# Altium schematic sheet Main.SchDoc
size 381 x 241 mm; SheetNumber: 1; SheetTotal: 1
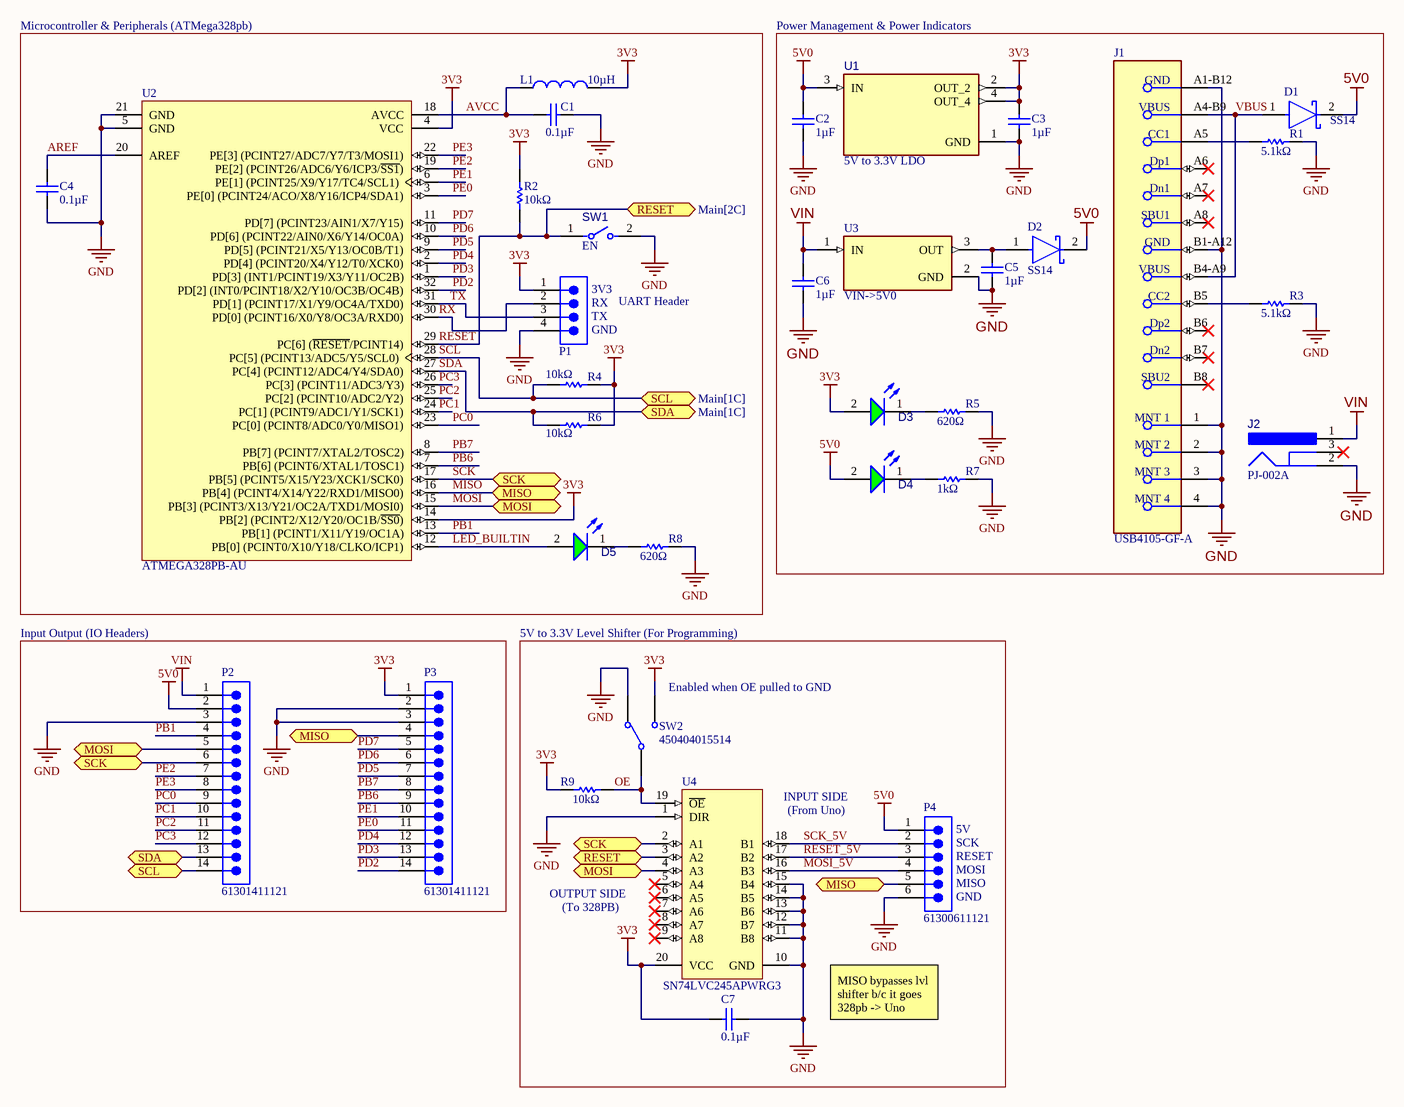
[diagram p0: Main.SchDoc]

## Parts
C1  0.1µF  [CAPC3216X100X50LL20T25]
C2  1µF  [CAPC3216X110X50LL20T25]
C3  1µF  [CAPC3216X110X50LL20T25]
C4  0.1µF  [CAPC3216X100X50LL20T25]
C5  1µF  [CAPC3216X110X50LL20T25]
C6  1µF  [CAPC3216X110X50LL20T25]
C7  0.1µF  [CAPC3216X100X50LL20T25]
D1  SS14  [FP-403AE-MFG]
D2  SS14  [FP-403AE-MFG]
D3  150120GS75000  [WL-SMCW_1206_150120xx75000]  (value not drawn)
D4  150120GS75000  [WL-SMCW_1206_150120xx75000]  (value not drawn)
D5  150120GS75000  [WL-SMCW_1206_150120xx75000]  (value not drawn)
J1  USB4105-GF-A  [FP-USB4105-GF-A-MFG]
J2  PJ-002A  [CUI-PJ-002A_V]
L1  10µH  [WE-MI_1206_L3.2W1.6H1.1]
P1  61300411121  [61300411121]  (value not drawn)
P2  61301411121  [61301411121]
P3  61301411121  [61301411121]
P4  61300611121  [61300611121]
R1  5.1kΩ  [RESC3116X65X40LL10T20]
R2  10kΩ  [RESC3116X65X40LL10T20]
R3  5.1kΩ  [RESC3116X65X40LL10T20]
R4  10kΩ  [RESC3116X65X40LL10T20]
R5  620Ω  [RESC3116X65X40LL10T20]
R6  10kΩ  [RESC3116X65X40LL10T20]
R7  1kΩ  [RESC3116X65X40LL10T20]
R8  620Ω  [RESC3116X65X40LL10T20]
R9  10kΩ  [RESC3116X65X40LL10T20]
SW1  EN  [FP-B3U-1000P-B-MFG]
SW2  450404015514  [450404015514]
U1  TLV1117LV33DCYR  [VREG_TLV1117LV33DCYR]  (value not drawn)
U2  ATMEGA328PB-AU  [ATML-32A_L]
U3  VIN->5V0  [DPAK229P990X238-4N]
U4  SN74LVC245APWRG3  [PW0020A_N]

## Blocks framed on the sheet
Input Output (IO Headers): P2 P3

## Ports
MISO (bidir, see Main[1C], Main[2B]), MISO (bidir, see Main[1C], Main[3C]), MISO (bidir, see Main[2B], Main[3C]), MOSI (bidir, see Main[1C], Main[2B]), MOSI (bidir, see Main[1C], Main[2C]), MOSI (bidir, see Main[2B], Main[2C]), RESET (bidir, see Main[2A]), RESET (bidir, see Main[2C]), SCK (bidir, see Main[1C], Main[2B]), SCK (bidir, see Main[1C], Main[2C]), SCK (bidir, see Main[2B], Main[2C]), SCL (bidir, see Main[1C]), SCL (bidir, see Main[2B]), SDA (bidir, see Main[1C]), SDA (bidir, see Main[2B])

## Nets
3V3: C3.2 C7.1 D3.2(A) L1.2 P1.1 P3.1 R2.2 R4.2 R6.2 R9.2 SW2.L2 U1.2(OUT_2) U1.4(OUT_4) U2.4(VCC) U2.14(PB[2]_(PCINT2/X12/Y20/OC1B/~{SS0})) U4.20(VCC)
5V0: C2.2 D1.2(C) D2.2(C) D4.2(A) P2.2 P4.1 U1.3(IN)
GND: C1.1 C2.1 C3.1 C4.2 C5.1 C6.1 C7.2 J1.1(MNT_1) J1.2(MNT_2) J1.3(MNT_3) J1.4(MNT_4) J1.A1-B12(GND) J1.B1-A12(GND) J2.2 P1.4 P2.3 P3.2 P3.3 P4.6 R1.1 R3.2 R5.2 R7.2 R8.2 SW1.2 SW2.L1 U1.1(GND) U2.5(GND) U2.21(GND) U3.2(GND) U4.1(DIR) U4.10(GND) U4.11(B8) U4.12(B7) U4.13(B6) U4.14(B5) U4.15(B4)
VIN: C6.2 J2.1 P2.1 U3.1(IN)
AREF: C4.1 U2.20(AREF)
AVCC: C1.2 L1.1 U2.18(AVCC)
LED_BUILTIN: D5.2(A) U2.12(PB[0]_(PCINT0/X10/Y18/CLKO/ICP1))
MISO: P3.4 P4.5 U2.16(PB[4]_(PCINT4/X14/Y22/RXD1/MISO0)) ; port MISO
MOSI: P2.5 U2.15(PB[3]_(PCINT3/X13/Y21/OC2A/TXD1/MOSI0)) U4.4(A3) ; port MOSI
MOSI_5V: P4.4 U4.16(B3)
OE: R9.1 SW2.COM U4.19(~{OE})
PB1: P2.4 U2.13(PB[1]_(PCINT1/X11/Y19/OC1A))
PB6: P3.9 U2.7(PB[6]_(PCINT6/XTAL1/TOSC1))
PB7: P3.8 U2.8(PB[7]_(PCINT7/XTAL2/TOSC2))
PC0: P2.9 U2.23(PC[0]_(PCINT8/ADC0/Y0/MISO1))
PC1: P2.10 U2.24(PC[1]_(PCINT9/ADC1/Y1/SCK1))
PC2: P2.11 U2.25(PC[2]_(PCINT10/ADC2/Y2))
PC3: P2.12 U2.26(PC[3]_(PCINT11/ADC3/Y3))
PD2: P3.14 U2.32(PD[2]_(INT0/PCINT18/X2/Y10/OC3B/OC4B))
PD3: P3.13 U2.1(PD[3]_(INT1/PCINT19/X3/Y11/OC2B))
PD4: P3.12 U2.2(PD[4]_(PCINT20/X4/Y12/T0/XCK0))
PD5: P3.7 U2.9(PD[5]_(PCINT21/X5/Y13/OC0B/T1))
PD6: P3.6 U2.10(PD[6]_(PCINT22/AIN0/X6/Y14/OC0A))
PD7: P3.5 U2.11(PD[7]_(PCINT23/AIN1/X7/Y15))
PE0: P3.11 U2.3(PE[0]_(PCINT24/ACO/X8/Y16/ICP4/SDA1))
PE1: P3.10 U2.6(PE[1]_(PCINT25/X9/Y17/TC4/SCL1))
PE2: P2.7 U2.19(PE[2]_(PCINT26/ADC6/Y6/ICP3/~{SS1}))
PE3: P2.8 U2.22(PE[3]_(PCINT27/ADC7/Y7/T3/MOSI1))
RESET: R2.1 SW1.1 U2.29(PC[6]_(~{RESET}/PCINT14)) U4.3(A2) ; port RESET
RESET_5V: P4.3 U4.17(B2)
RX: P1.2 U2.30(PD[0]_(PCINT16/X0/Y8/OC3A/RXD0))
SCK: P2.6 U2.17(PB[5]_(PCINT5/X15/Y23/XCK1/SCK0)) U4.2(A1) ; port SCK
SCK_5V: P4.2 U4.18(B1)
SCL: P2.14 R4.1 U2.28(PC[5]_(PCINT13/ADC5/Y5/SCL0)) ; port SCL
SDA: P2.13 R6.1 U2.27(PC[4]_(PCINT12/ADC4/Y4/SDA0)) ; port SDA
TX: P1.3 U2.31(PD[1]_(PCINT17/X1/Y9/OC4A/TXD0))
VBUS: D1.1(A) J1.A4-B9(VBUS) J1.B4-A9(VBUS)
NetC5_2: C5.2 D2.1(A) U3.3(OUT)
NetD3_1: D3.1(K) R5.1
NetD4_1: D4.1(K) R7.1
NetD5_1: D5.1(K) R8.1
NetJ1_A5: J1.A5(CC1) R1.2
NetJ1_B5: J1.B5(CC2) R3.1

Not connected (* = marked no-connect by the designer): J1 A6(Dp1)* A7(Dn1)* A8(SBU1)* B6(Dp2)* B7(Dn2)* B8(SBU2)*; J2 3*; U4 5(A4)* 6(A5)* 7(A6)* 8(A7)* 9(A8)*

## Notes on the sheet
- Microcontroller & Peripherals (ATMega328pb)
- Power Management & Power Indicators
- (near U1) 5V to 3.3V LDO
- 3V3
- (near P1) TX
- (near P1) RX
- GND
- UART Header
- 5V to 3.3V Level Shifter (For Programming)
- (near SW2) Enabled when OE pulled to GND
- (near U4) INPUT SIDE
- (near U4) (From Uno)
- (near P4) 5V
- (near P4) MISO
- (near P4) MOSI
- (near P4) SCK
- (near P4) RESET
- OUTPUT SIDE
- (To 328PB)
- (near P4) GND
- MISO bypasses lvl shifter b/c it goes 328pb -> Uno

## Library data of the parts
C1 C4 C7 = CMP-1664-00001-4: Chip Capacitor, 100 nF, +/- 10%, 25 V, -55 to 125 degC, 1206 (3216 Metric), RoHS, Tape and Reel; Manufacturer: Kemet; Voltage Rating: 25 V; ComponentLink1URL: http://www.kemet.com/; Max Operating Temperature: 125 degC; PackageReference: 1206; ComponentLink2URL: http://www.kemet.com/docfinder?Partnumber=C1206F104K3RACTU; ComponentLink1Description: Manufacturer URL; ComponentLink2Description: Datasheet; Length: 3.2 mm; Packaging: Tape and Reel; Height: 0.78 mm; Mounting Technology: Surface Mount; REACH SVHC: No SVHC; PackageDescription: 2-Pin Surface Mount Device, Body 3.2 x 1.6 mm; Min Operating Temperature: -55 degC; RoHSCompliant: true; DatasheetVersion: 02/2016; Package Quantity: 4000
C2 C3 C5 C6 = CMP-2000-06011-1: Chip Capacitor, 1 uF, +/- 10%, 50 V, -55 to 125 degC, 1206 (3216 Metric), RoHS, Tape and Reel; Manufacturer: Kemet; Case Height: 1mm; Dielectric: X7R; Voltage Rating: 50V; Capacitance: 1uF; Temperature Coefficient / Code: +/-15%; Case Length: 3.2mm; Case Width: 1.6mm; Type: SMDMLCCX7R6.3-250VDCCommericalGrade; Class: Class1; Capacitance - nF: 1000nF; Datasheet URL: http://www.kemet.com/docfinder?Partnumber=C1206C105K5RACTU; Product Category: MultilayerCeramicCapacitorsMLCC-SMD/SMT; Termination Style: SMD/SMT; Dimensions: 1.6mmWx3.2mmLx1mmH; Voltage Rating DC: 50V; Datasheet Version: 02/2016; Packaging: Reel; Brand: Kemet; RoHS: Details; Minimum Operating Temperature: -55C; Operating Temperature Range: -55Cto+125C; Package Reference: 1206; Manufacturer URL: http://www.kemet.com/; Product: GeneralTypeMLCCs; Tolerance: 10%; Package Description: 2-Pin Surface Mount Device, Body 3.2 x 1.6 mm; Mounting Technology: SurfaceMount; Case Code - mm: 3216; Maximum Operating Temperature: +125C; Series: C1206C; Factory Pack Quantity: 2500; Package / Case: 1206(3216metric); Case Code - in: 1206
D1 D2 = CMP-2000-04943-2: DIODE SCHOTTKY 40V 1A SMA; Manufacturer: ON Semiconductor; Peak Reverse Current: 0.2mA; Max Junction Temp: +125°C; Standoff Height: 0.05mm; Max Surge Forward Current: 40A; Mouser Description: Schottky Diodes & Rectifiers SMA 40V 1.0A; RoHS: TRUE; Lead Free: Yes; Manufacturer Part Number: SS14; Device Class L3: Schottky Diodes; Category: Diode; Automotive: No; Digikey Description: DIODE SCHOTTKY 40V 1A SMA; ComponentLink2Description: Datasheet; Device Class L2: Diodes; Height: 2.5mm; Temperature Range High: +125°C; ComponentLink2URL: https://www.onsemi.com/pub/Collateral/SS19-D.PDF; Device Class L1: Discrete Semiconductors; Package: 403AE; Octopart: https://octopart.com/ss14-on+semiconductor-29205033; Max Repetitive Reverse Voltage: 40V; Temperature Range Low: -65°C; Forward Current: 1A; Temperature: -65°C to +125°C
D3-D5 = CMP-1426-00014-4: WL-SMCW SMT Mono-Color Chip LED Waterclear; Dominant Wavelength: 525nm; Reverse Voltage: 5V; Max Junction Temperature (Tj): 95°C; Lens Style: Clear, Rectangular; Forward Voltage: 3.2V; Power Dissipation: 105mW; Peak Wavelength: 515nm; Test Current: 20mA; Color: Green; Forward Current: 100mA; Luminous Intensity: 450mcd; Viewing Angle: 140°; Case Code (Imperial): 1206; REACH SVHC: Unknown; Packaging: Tape and Reel; Max Operating Temperature: 85°C; Case/Package: 1206; Height: 680µm; Length: 3.2mm; Mount: Surface Mount; Min Operating Temperature: -40°C; Width: 1.6mm; Case Code (Metric): 3216; Max Reverse Voltage (DC): 5V; RoHS: Compliant; Wavelength: 525nm
J1 = CMP-245163-000001-1: CONN RCPT USB2.0 TYPEC 5A; Manufacturer: GCT; Voltage Rating: 20V; Is Female: yes; Current Rating: 5/6.25/1.25/0.25A; Number Of Contacts: 16; Conn Orientation: Right Angle; Device Class L1: Connectors; Category: Conn; Lead Free: Yes; RoHS: TRUE; Temperature Range High: +85°C; Digikey Description: CONN RCPT USB2.0 TYPEC 5A; Device Class L3: unset; ComponentLink2Description: Datasheet; Manufacturer Part Number: USB4105-GF-A; Package: 0; Usb Standard: USB 2.0; Device Class L2: USB Connectors; Automotive: No; Temperature Range Low: -40°C; Height: 3.46mm; Temperature: -40°C to +85°C; Contact Material: Gold,Nickel; ComponentLink2URL: https://gct.co/files/drawings/usb4105.pdf; Octopart: https://octopart.com/usb4105-gf-a-gct-106627878
J2 = CMP-2000-06895-2: Through Hole Right Angle DC Power Jack, 2.5 A, 2 mm Center Pin, 3 Position, -25 to 85 degC, RoHS, Bulk; Manufacturer: CUIInc.; Brand: CUI; Inside Contact Diameter: 2mm; Voltage Rating: 24V; Outside Contact Diameter: 6.5mm; Current Rating: 2.5A; Insulation Resistance: 50MOhms; Contact Gender: Male; Connector Type: DCPowerJack; Datasheet Version: Rev. 1.03, 04/2016; Housing Material: PolybutyleneTerephthalate(PBT); Operating Temperature Range: -25Cto+85C; Termination Style: ThroughHole; Product Category: DCPowerConnectors; Mounting Technology: ThroughHole; Mounting Style: ThroughHole; Factory Pack Quantity: 500; Contact Plating: Nickel; Package Reference: PJ-002A; Mounting Angle: Right; Package Description: 3-Pin Through Hole Device, Body 14.4 x 9 mm, Height 11 mm; Flammability Rating: UL94V-0; Manufacturer URL: http://www.cui.com/; Product: Jacks; Contact Material: Copper; Datasheet URL: http://www.cui.com/product/resource/pj-002a.pdf; RoHS: True
L1 = CMP-0221-00030-2: NexarPartId: 23259292; Max DC Current: 25mA; Inductance Tolerance: 10%; Core Material: Ferrite; Shielding: Unshielded; DC Resistance (DCR): 500mΩ; Self Resonant Frequency: 26MHz; Ambient Temperature Range Low: -55°C; RoHS: Compliant; Inductance: 10µH; Tolerance: 10%; Length: 3.2mm; Width: 1.6mm; Case/Package: SMD/SMT; Min Operating Temperature: -55°C; Ambient Temperature Range High: 85°C; Depth: 1.6mm; Current Rating: 25mA; Max Operating Temperature: 125°C; Height: 1.1mm
P1 = 61300411121: WR-PHD Pin Header, THT, Vertical, pitch 2.54mm, 1 Row, 4P; Manufacturer: Wurth Elektronik; Contact Resistance: 20mOhm; Rated Current: 3A; Working Voltage: 250V; Withstanding Voltage: 500V; Manufacturer Part Number: 61300411121; Category: Board-to-Board Connectors; Match Code: WR-PHD; ComponentLink1Description: Website Link; ComponentLink1URL: https://www.we-online.com/redexpert/article/61300411121?ad; ComponentLink2Description: Datasheet Link; ComponentLink2URL: https://www.we-online.com/redexpert/spec/61300411121?ad; Mount: Through Hole; Operating Temperature Max: 105°C; Operating Temperature Min: -40°C; Packaging: Bag; Gender: Pin Header; Number of Pins: 4; Number of Rows: 1; Orientation: Vertical; Pitch: 2.54mm
P2 P3 = CMP-1502-01091-3: NexarPartId: 32855543; Pitch: 2.54mm; Operating Supply Voltage: 250V; Contact Resistance: 20mΩ; Gender: Male; Connector Type: Male Pin; Number of Positions: 14; Current Rating: 3A; Height: 8.89mm; Packaging: Bulk; Min Operating Temperature: -40°C; Lead Free: Lead Free; Number of Rows: 1; Max Operating Temperature: 105°C; Orientation: Vertical; Color: Black; Mount: Through Hole; Lead Pitch: 2.54mm; Termination: Solder; Contact Material: Copper; REACH SVHC: Unknown; Voltage Rating: 250V; Number of Contacts: 14; RoHS: Compliant; Contact Mating Length: 5.9944mm; Number of Pins: 14; Contact Plating: Gold
P4 = CMP-1502-01070-3: NexarPartId: 20084590; Current Rating: 3A; Pitch: 2.54mm; Gender: Male; Operating Supply Voltage: 250V; Connector Type: Male Pin; Number of Positions: 6; Contact Resistance: 20mΩ; Packaging: Bulk; Number of Pins: 6; Number of Rows: 1; Contact Plating: Gold; Lead Free: Lead Free; RoHS: Compliant; Contact Mating Length: 5.9944mm; Voltage Rating: 250V; REACH SVHC: Unknown; Contact Gender: Male; Housing Material: PBT; Min Operating Temperature: -40°C; Lead Pitch: 2.54mm; Mount: Through Hole; Number of Contacts: 6; Max Operating Temperature: 105°C; Contact Material: Copper; Orientation: Vertical; Termination: Through Hole; Color: Black; Height: 8.89mm
R1 R3 = CMP-2003-03990-1: Manufacturer: Yageo; Part Number: RC1206JR-075K1L
R2 R4 R6 R9 = CMP-1014-00623-2: Chip Resistor, 10 KOhm, +/- 1%, 0.25 W, -55 to 155 degC, 1206 (3216 Metric), RoHS, Tape and Reel; Manufacturer: Yageo; Voltage Rating: 200V; Resistance: 10KOhm; Temperature Coefficient: 100ppm/degreesC; Power Rating: 250mW; Packaging: TapeandReel; Termination: SMD/SMT; REACH SVHC: Unknown; Tolerance: 1%; Height: 0.55mm; Composition: ThickFilm; Max Operating Temperature: 155degC; Datasheet Version: Rev. 5, 10/2016; Lead Free: LeadFree; Case Code (Metric): 3216; Depth: 1.6mm; Package Quantity: 5000; RoHSCompliant: true; Military Standard: Not; Case/Package: 1206; Case Code (Imperial): 1206; Min Operating Temperature: -55degC; Datasheet URL: http://www.yageo.com/NewPortal/yageodocoutput?fileName=/pdf/R-Chip/PYu-RC_Group_51_RoHS_L_5.pdf; Length: 3.1mm; Manufacturer URL: http://www.yageo.com/; Package Reference: 1206.0; Width: 1.6mm; Package Description: 2-Pin Surface Mount Device, Body 3.1 x 1.6 mm
R5 R8 = CMP-2003-03994-1: Part Number: RC1206JR-07620RL; Manufacturer: Yageo
R7 = CMP-2100-03678-1: Chip Resistor, 1 KOhm, +/- 1%, 0.25 W, -55 to 155 degC, 1206 (3216 Metric), RoHS, Tape and Reel; Manufacturer: Yageo; Temperature Coefficient: 100ppm/degreesC; Power Rating: 250mW; Voltage Rating: 200V; Resistance: 1KOhm; Composition: ThickFilm; Min Operating Temperature: -55degC; Tolerance: 1%; REACH SVHC: Unknown; Case Code (Metric): 3216; Military Standard: Not; Datasheet Version: Rev. 5, 10/2016; Package Reference: 1206.0; Case/Package: 1206; Length: 3.1mm; Manufacturer URL: http://www.yageo.com/; Lead Free: LeadFree; RoHSCompliant: true; Termination: SMD/SMT; Packaging: TapeandReel; Package Description: 2-Pin Surface Mount Device, Body 3.1 x 1.6 mm; Depth: 1.6mm; Case Code (Imperial): 1206; Max Operating Temperature: 155degC; Datasheet URL: http://www.yageo.com/NewPortal/yageodocoutput?fileName=/pdf/R-Chip/PYu-RC_Group_51_RoHS_L_5.pdf; Height: 0.55mm
SW1 = CMP-08834-000005-1: SWITCH TACTILE SPST-NO 0.05A 12V; Manufacturer Part Number: B3U-1000P-B; Manufacturer: Omron; Operating Force: 1.5N; Contact Current Rating: 50mA; Contact Resistance: 100mΩ; Electromechanical Life: 200000Cycles; Height: 1.75mm; Device Class L2: Switches; Temperature Range High: +70°C; Digikey Description: SWITCH TACTILE SPST-NO 0.05A 12V; Throw Configuration: SPST-NO; Ambient Temperature Range High: +70°C; Temperature: -25°C to +70°C; Lead Free: Yes; ComponentLink2URL: https://omronfs.omron.com/en_US/ecb/products/pdf/en-b3u.pdf; Device Class L3: Tactile Switches; Ambient Temperature Range Low: -25°C; Mount: Surface Mount; Automotive: No; Mouser Description: Tactile Switches Top Actuated with boss w/o ground; Octopart: https://octopart.com/b3u-1000p-b-omron-1057356; RoHS: TRUE; Package: 0; Device Class L1: Electromechanical; Voltage Rating Dc: 12V; Category: Switch; Temperature Range Low: -25°C; ComponentLink2Description: Datasheet
SW2 = CMP-03913-99472344-1: 450404015514 Slide Switch, 0.3A, 5Vdc, Smd Rohs Compliant: Yes; Current Rating: 300mA; Insulation Resistance: 100MΩ; Voltage Rating: 5V; NexarPartId: 99472344; Min Operating Temperature: -40°C; Contact Plating: Silver; Packaging: Tape and Reel; Max Operating Temperature: 85°C; RoHS: Compliant
U1 = TLV1117LV33DCYR: 1-A, low-dropout voltage regulator; MF: Texas Instruments; Check_prices: https://www.snapeda.com/parts/TLV1117LV33DCYR/Texas+Instruments/view-part/?ref=eda; Value: *; MP: TLV1117LV33DCYR; Purchase-URL: https://pricing.snapeda.com/search/part/TLV1117LV33DCYR/?ref=eda; SnapEDA_Link: https://www.snapeda.com/parts/TLV1117LV33DCYR/Texas+Instruments/view-part/?ref=snap; Package: SOT-223-4 Texas Instruments; Digi-Key_Part_Number: 296-28778-2-ND
U2 = CMP-2000-07439-1: AVR Microcontroller, 1.8 to 5.5 V, 32 KB Flash, 1 KB EEPROM, 2 KB SRAM, -40 to 85 degC, 32-Pin TQFP (32A), RoHS, Tray; Manufacturer: Microchip; Datasheet URL: http://ww1.microchip.com/downloads/en/DeviceDoc/40001906A.pdf; Mounting Technology: SurfaceMount; RoHSCompliant: false; Manufacturer URL: http://www.microchip.com/; Package Description: 32-Pin Thin Profile Plastic Quad Flat Package, Body 7 x 7 mm, Pitch 0.8 mm; Package Reference: 32A; Datasheet Version: Rev. A, 04/2017
U3 = MC7805BDTRKG: Linear Voltage Regulator IC 1 Output 1A DPAK; MF: ON Semiconductor; MP: MC7805BDTRKG; Package: TO-252-3 Freescale Semiconductor; Price: None; Availability: Unavailable; Value: *; SnapEDA_Link: https://www.snapeda.com/parts/MC7805BDTRKG/ON%20Semiconductor/view-part/360207/?ref=snap
U4 = CMP-1620-00520-2: Octal Bus Transceiver With 3-State Outputs, PW0020A, LARGE T&R; Manufacturer: Texas Instruments; Input Type: TTL/CMOS; tpd @ Nom Voltage(Max)(ns): 12.7,8.3,7.3,6.3; Output Type: LVTTL; Bits(#): 8; VCC(Max)(V): 3.6; F @ Nom Voltage(Max)(Mhz): 100; Output Drive (IOL/IOH)(Max)(mA): -24/24; Rating: Catalog; Schmitt Trigger: No; ICC @ Nom Voltage(Max)(mA): 0.03; VCC(Min)(V): 1.65; Voltage(Nom)(V): 1.8,2.5,2.7,3.3; Technology Family: LVC; DatasheetVersion: SCAS218X; PackageReference: PW0020A; Generic Part Number: SN74LVC245A; Code_JEDEC: MO-153; Operating Temperature Range(C): -40 to 125